# EAGLE design Genesis giraffe1 (EAGLE 9.1.0)
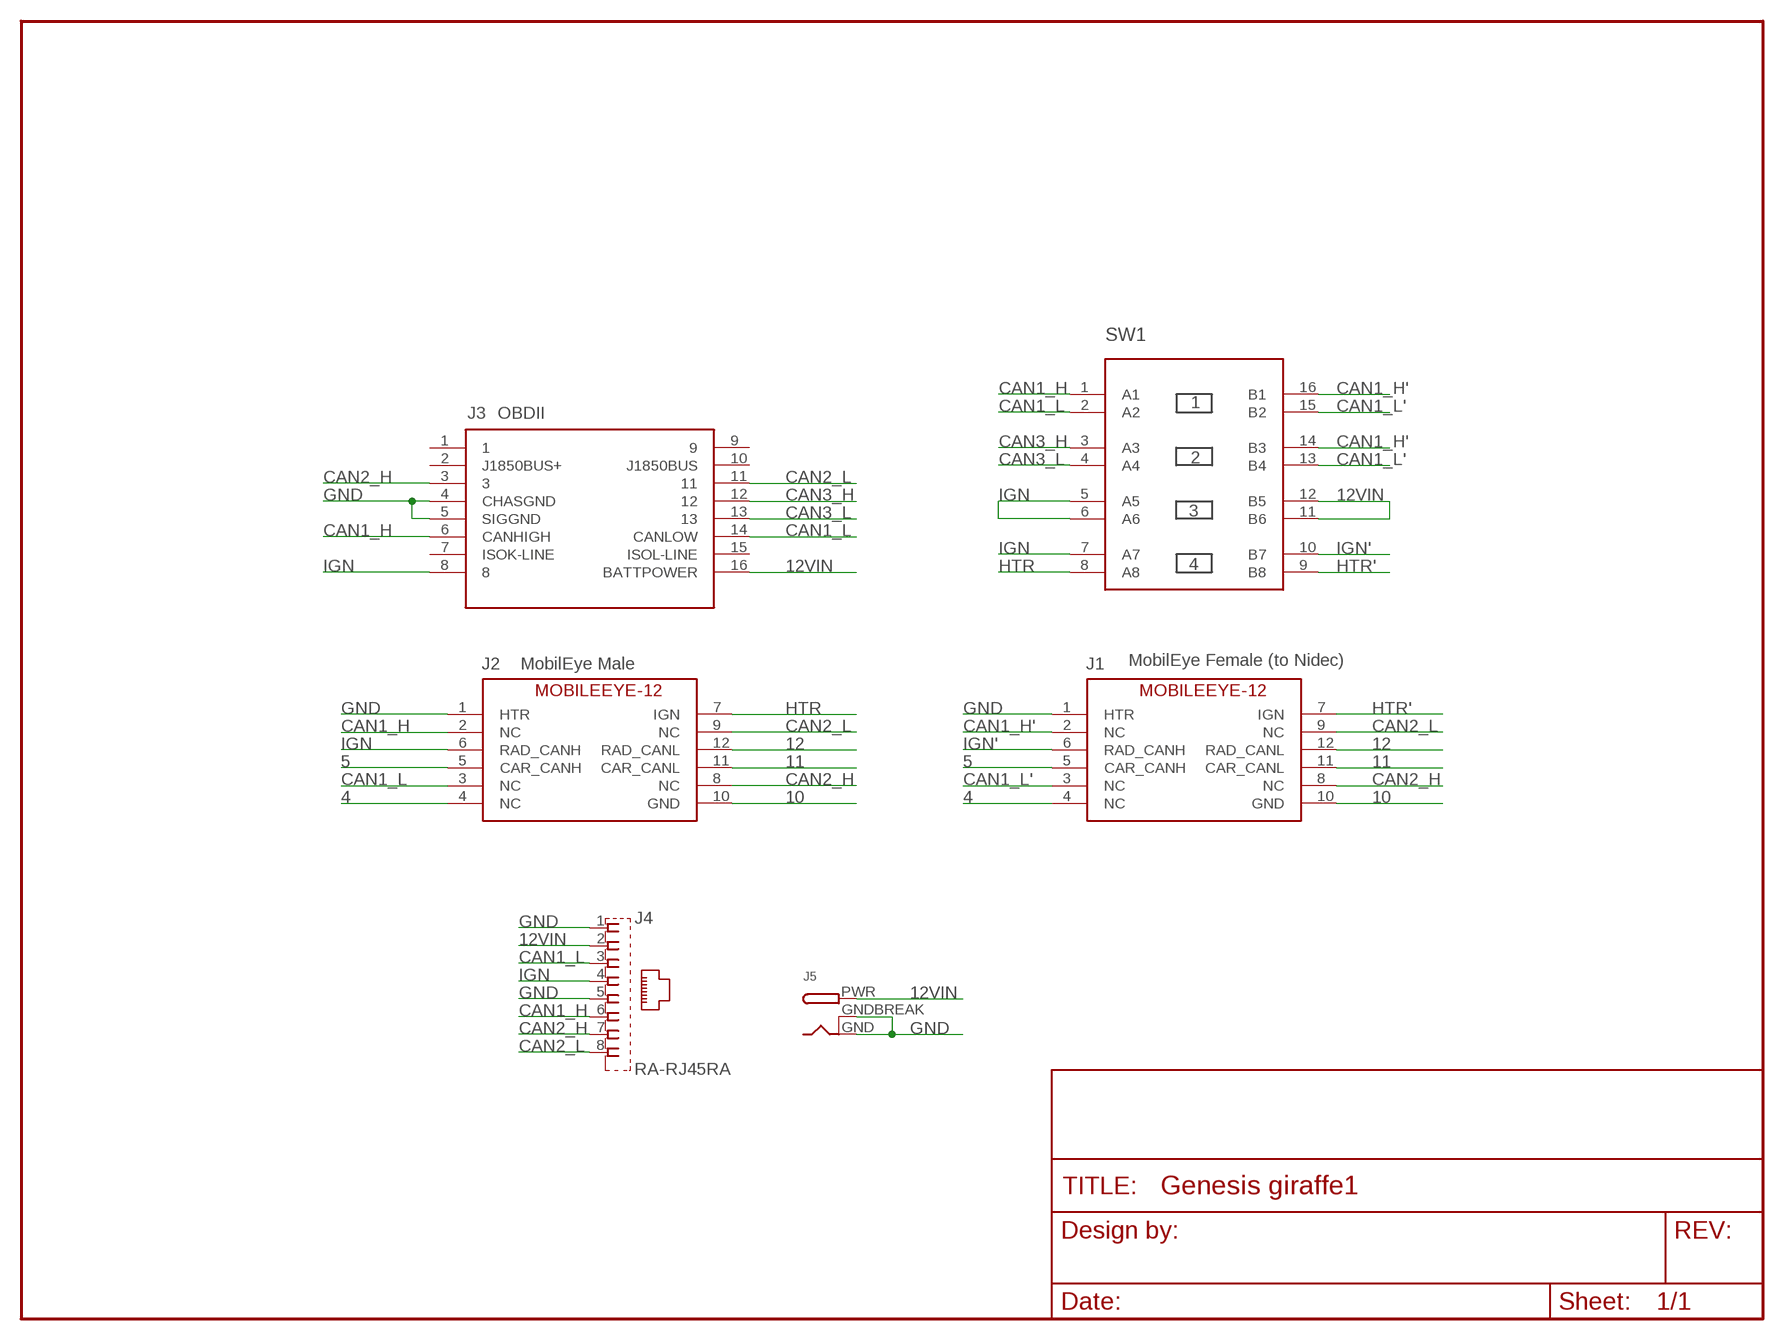
[diagram p0: schematic, sheet 1]

## Parts
FRAME1  FRAME-LETTERNO_PACKAGE  [DUMMY]
J1  MOBILEEYE-12FEMALE  [2X6-TE-FEMALE]
J2  MOBILEEYE-12MALE  [2X6-TE-RA]
J3  OBDII-FEMALE-CUT  [OBDII-FEMALE-MIDCUT]
J4  RA-RJ45RA  [RA-RJ45]
J5  DCBARRELPTH  [DCJACK_2MM_PTH]
SW1  4XDPSTSMT  [4-DPST]

## Nets
4: J1.4(NC) J2.4(NC)
5: J1.5(CAR_CANH) J2.5(CAR_CANH)
10: J1.10(GND) J2.10(GND)
11: J1.11(CAR_CANL) J2.11(CAR_CANL)
12: J1.12(RAD_CANL) J2.12(RAD_CANL)
12VIN: J3.16(BATTPOWER) J4.2 J5.PWR SW1.11(B6) SW1.12(B5)
CAN1_H: J2.2(NC) J3.6(CANHIGH) J4.6 SW1.1(A1)
CAN1_H': J1.2(NC) SW1.14(B3) SW1.16(B1)
CAN1_L: J2.3(NC) J3.14(CANLOW) J4.3 SW1.2(A2)
CAN1_L': J1.3(NC) SW1.13(B4) SW1.15(B2)
CAN2_H: J1.8(NC) J2.8(NC) J3.3 J4.7
CAN2_L: J1.9(NC) J2.9(NC) J3.11 J4.8
CAN3_H: J3.12 SW1.3(A3)
CAN3_L: J3.13 SW1.4(A4)
GND: J1.1(HTR) J2.1(HTR) J3.4(CHASGND) J3.5(SIGGND) J4.1 J4.5 J5.GND J5.GNDBREAK
HTR: J2.7(IGN) SW1.8(A8)
HTR': J1.7(IGN) SW1.9(B8)
IGN: J2.6(RAD_CANH) J3.8 J4.4 SW1.5(A5) SW1.6(A6) SW1.7(A7)
IGN': J1.6(RAD_CANH) SW1.10(B7)
Unconnected: J3.1 J3.2(J1850BUS+) J3.7(ISOK-LINE) J3.9 J3.10(J1850BUS) J3.15(ISOL-LINE)

## Notes on the sheet
- OBDII
- MobilEye Male | MobilEye Female (to Nidec)

## Library data of the parts
FRAME1 = SparkFun-Aesthetics:FRAME-LETTER: Schematic Frame Standard 8.5x11 US Letter frame; DESIGNER: Nobody; VERSION: v01
J1 J2 = comma.ai:MOBILEEYE-12
J3 = comma.ai:OBDII-FEMALE
J4 = comma.ai:RA-RJ45
J5 = adafruit:DCBARREL: 2.0mm DC Barrel Jack DCJACK_2MM_PTH - Through Hole Jack (4UConnector: 05537)
SW1 = comma.ai:4XDPST

## Board
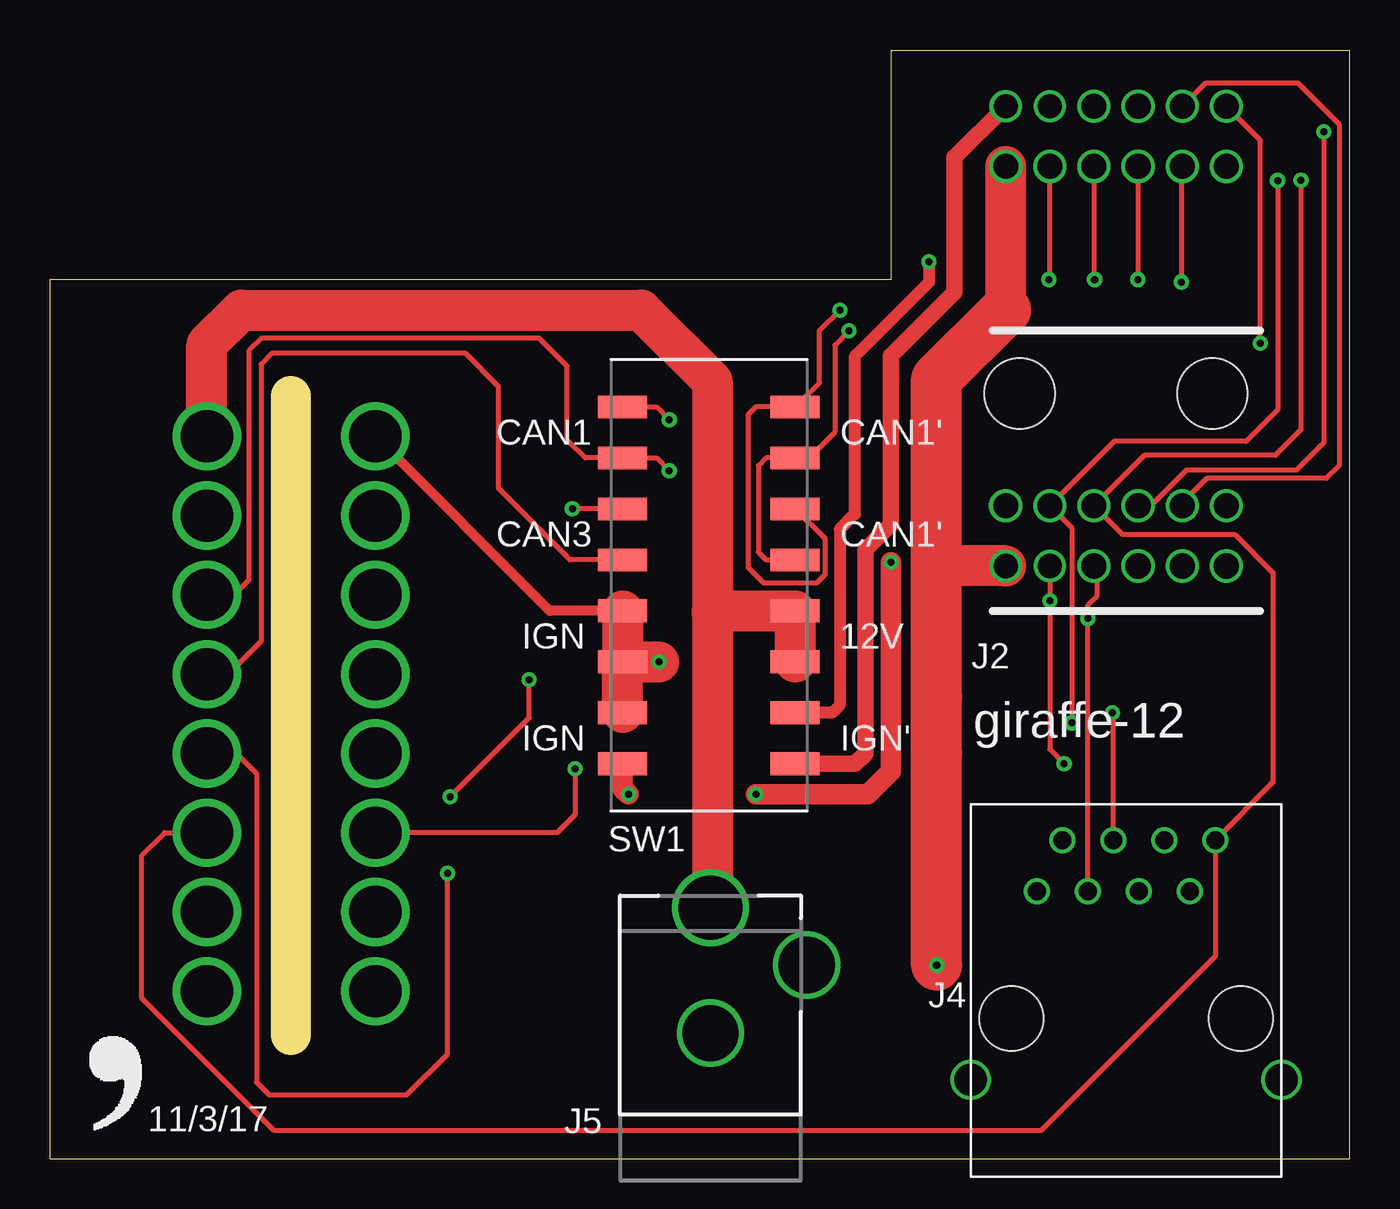
[diagram p1: board, top side]
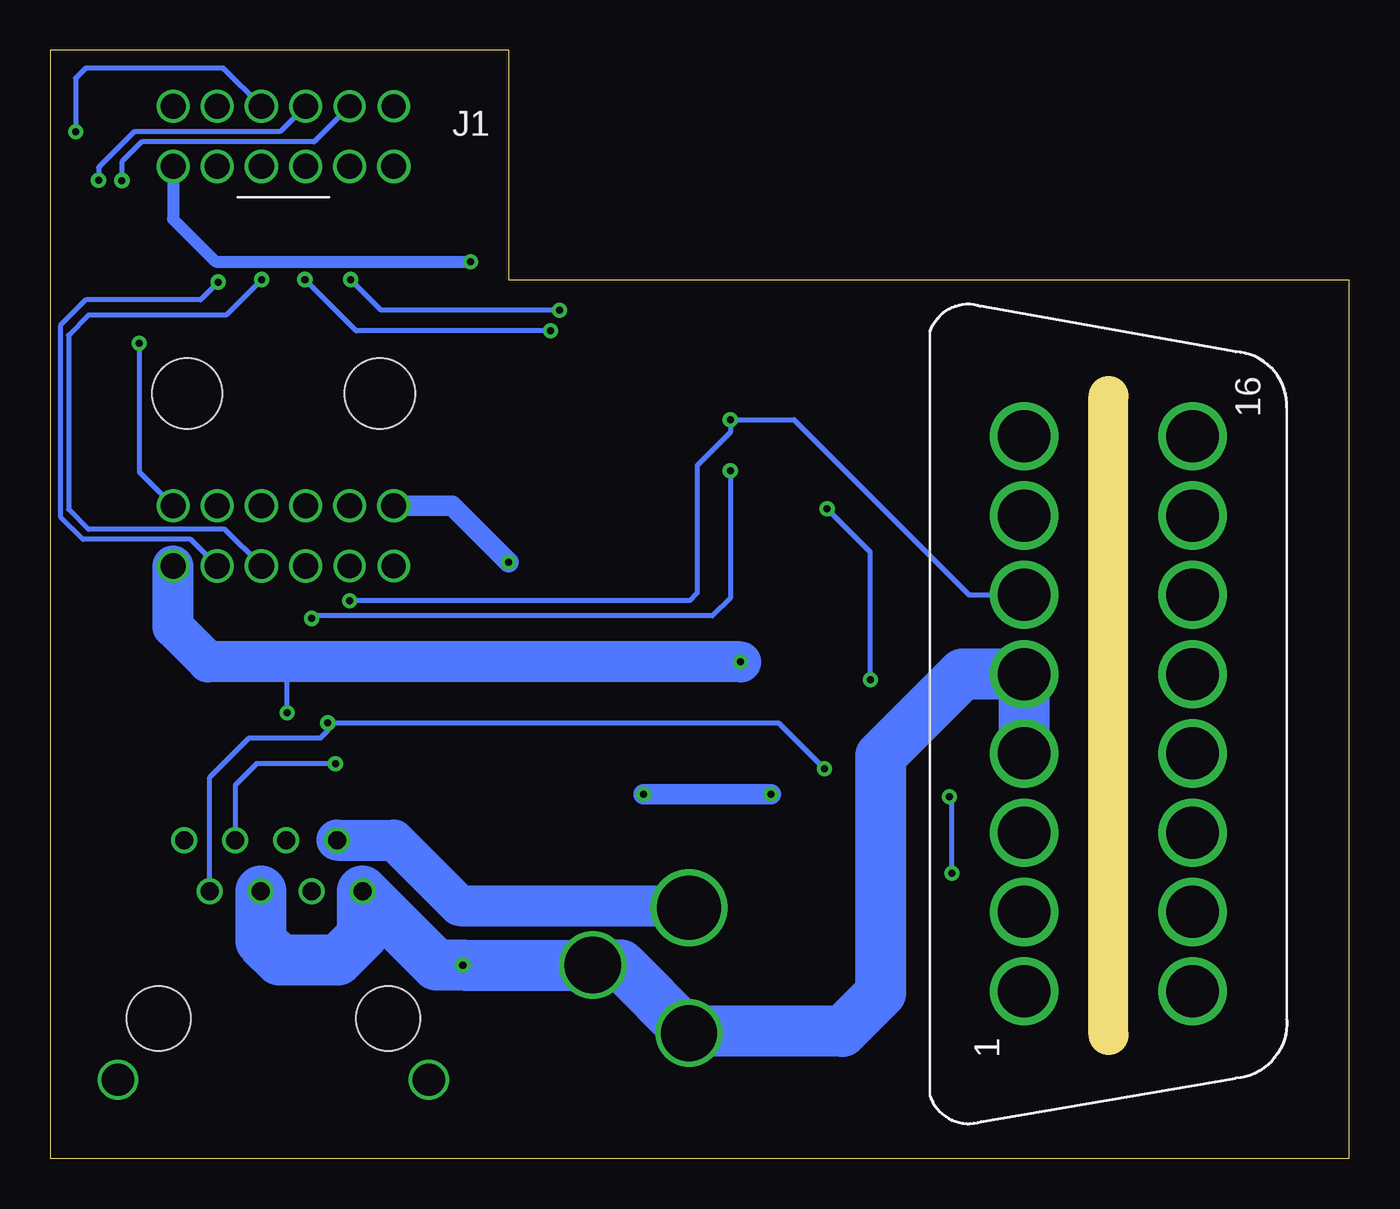
[diagram p2: board, bottom side, seen from below]

Size 64.77 x 55.24 mm. Coordinates in mm from the lower left corner, seen from the top.
Outline: 12.01,6.17 12.01,38
Outline: 41.91,55.24 64.77,55.24 64.77,0 0,0 0,43.81 41.91,43.81 41.91,55.24
Copper layers (1*16): Top 0.035mm / dielectric 1.5mm / Bottom 0.035mm
Design rules "default *": minimum track width 6mil, minimum drill 10mil, track to track 6mil, track to pad 6mil, pad to pad 6mil, via to via 6mil, smd to smd 6mil, copper to edge 15mil, drill to drill 10mil, minimum pad ring 8mil, minimum via ring 8mil, stop-mask expansion 4mil, vias tented up to drill 0mil, thermal gap 10mil

### Footprints (pad centres in the part's own frame; a part is rotated, then mirrored left to right if it is on the bottom)
2X6-TE-FEMALE = drill 1.25: 1 -5.5,1.5; 2 -3.3,1.5; 3 -1.1,1.5; 4 1.1,1.5; 5 3.3,1.5; 6 5.5,1.5; 9 -1.1,-1.5; 10 1.1,-1.5; 11 3.3,-1.5; 12 5.5,-1.5 | drill 1.2: 7 -5.5,-1.5; 8 -3.3,-1.5
2X6-TE-RA = drill 1.2: 1 -5.5,-1.5; 2 -3.3,-1.5 | drill 1.25: 3 -1.1,-1.5; 4 1.1,-1.5; 5 3.3,-1.5; 6 5.5,-1.5; 7 -5.5,1.5; 8 -3.3,1.5; 9 -1.1,1.5; 10 1.1,1.5; 11 3.3,1.5; 12 5.5,1.5 | hole 3.5: -4.8,7.1; 4.8,7.1
OBDII-FEMALE-MIDCUT = drill 2.6 pad 3.4: 1 13.825,-4.2; 2 9.875,-4.2; 3 5.925,-4.2; 4 1.975,-4.2; 5 -1.975,-4.2; 6 -5.925,-4.2; 7 -9.875,-4.2; 8 -13.825,-4.2; 9 13.825,4.2; 10 9.875,4.2; 11 5.925,4.2; 12 1.975,4.2; 13 -1.975,4.2; 14 -5.925,4.2; 15 -9.875,4.2; 16 -13.825,4.2
RA-RJ45 = drill 0.9: 1 -4.445,6.35; 2 -3.175,8.89; 3 -1.905,6.35; 4 -0.635,8.89; 5 0.635,6.35; 6 1.905,8.89; 7 3.175,6.35; 8 4.445,8.89 | drill 1.6: P$1 -7.75,-3.05; P$2 7.75,-3.05 | hole 3.2: -5.715,0; 5.715,0
DCJACK_2MM_PTH = drill 2.8: GND 0,7.35; GNDBREAK 4.8,10.75 | drill 3.2: PWR 0,13.6
4-DPST = smd 1.13 x 2.44: 1 -8.89,-4.3; 2 -6.35,-4.3; 3 -3.81,-4.3; 4 -1.27,-4.3; 5 1.27,-4.3; 6 3.81,-4.3; 7 6.35,-4.3; 8 8.89,-4.3; 9 8.89,4.3; 10 6.35,4.3; 11 3.81,4.3; 12 1.27,4.3; 13 -1.27,4.3; 14 -3.81,4.3; 15 -6.35,4.3; 16 -8.89,4.3

### Placement (x,y rotation side)
FRAME1  -8.89,-10.79 0 top  (outside the outline)
J1  53.14,50.95 180 bottom
J2  53.14,31.04 0 top
J3  12.01,22.17 270 bottom
J4  53.64,6.99 0 top
J5  32.92,-1.09 0 top
SW1  32.84,28.57 270 top
U$1  [LOGO]  1.3,1.12 0 top

### Tracks (layer width: path | path; a pad name or v marks a point on that pad's centre or on a via)
4  (via drill 0.35)
  Top 0.254: J1.4 v54.24,43.81 v54.23,43.81
  Bottom 0.254: J2.4 56.07,31.37 62.87,31.37 63.86,32.36 63.86,41.05 62.87,42.04 56.01,42.04 v54.23,43.81
5  (via drill 0.35)
  Top 0.254: J1.5 56.39,49.45 v56.39,43.69
  Bottom 0.254: J2.5 57.76,30.86 63.12,30.86 64.26,32 64.26,41.53 62.99,42.8 57.28,42.8 v56.39,43.69
10  (via drill 0.35)
  Top 0.254: v63.5,51.18 63.5,35.69 62.13,34.31 56.65,34.31 54.87,32.54 J2.10
  Bottom 0.254: J1.10 56.14,54.36 62.99,54.36 63.5,53.85 v63.5,51.18
11
  Top 0.254: 62.23,53.59 64.26,51.56 64.26,34.54 63.63,33.91 57.66,33.91 56.44,32.69 J2.11 | 62.23,53.59 | 62.23,53.59 57.58,53.59 J1.11
12  (via drill 0.35)
  Top 0.254: v60.33,40.64 60.33,50.76 J1.12
  Bottom 0.254: J2.12 60.33,34.23 60.33,40.51 v60.33,40.64
12VIN
  Top 2.032: J5.PWR 33.02,12.51 33.02,27.18 33.02,27.3 | 33.02,27.3 SW1.12 SW1.11 | J3.16 7.81,40.58 9.53,42.29 29.46,42.29 33.02,38.73 33.02,27.3
  Bottom 2.032: J5.PWR 33.02,12.61 44.36,12.61 47.62,15.88 J4.2
CAN1_H  (via drill 0.35)
  Top 0.254: J2.2 v49.84,27.81 49.84,20.39 v50.55,19.68 | SW1.1 30.23,37.47 v30.86,36.83
  Bottom 0.254: v50.55,19.68 54.48,19.68 55.55,18.62 J4.6 | v49.84,27.81 32.89,27.81 32.51,28.19 32.51,34.54 30.86,36.2 v30.86,36.83 27.69,36.83 18.95,28.1 J3.6
CAN1_H'  (via drill 0.35)
  Top 0.254: v39.37,42.29 38.35,41.27 38.35,38.68 SW1.16 35.18,37.47 34.8,37.08 34.8,29.46 35.56,28.7 38.23,28.7 38.64,29.12 38.64,30.89 SW1.14 | v49.78,43.81 49.84,43.87 J1.2
  Bottom 0.254: v39.37,42.29 48.26,42.29 v49.78,43.81
CAN1_L  (via drill 0.35)
  Top 0.254: J4.3 v51.73,26.92 51.73,27.61 52.2,28.07 52.2,29.38 J2.3 | v30.86,34.29 30.23,34.92 SW1.2 26.67,34.92 25.78,35.81 25.78,39.5 24.38,40.89 | 24.38,40.89 | 24.38,40.89 10.54,40.89 9.91,40.26 9.91,28.83 9.18,28.1 J3.14
  Bottom 0.254: v30.86,34.29 30.86,27.94 31.75,27.05 51.61,27.05 v51.73,26.92
CAN1_L'  (via drill 0.35)
  Top 0.254: v39.82,41.26 39.12,40.55 39.12,36.2 37.85,34.92 SW1.15 35.69,34.92 35.31,34.54 35.31,30.23 35.69,29.84 SW1.13 | v52.07,43.81 52.07,49.42 J1.3
  Bottom 0.254: v39.82,41.26 49.51,41.26 v52.07,43.81
CAN2_H  (via drill 0.35)
  Top 0.254: v50.93,21.72 50.93,31.45 J2.8 53.05,35.75 59.63,35.75 61.19,37.32 v61.19,48.75 | v26.16,19.43 26.16,17.14 25.27,16.26 J3.3
  Bottom 0.254: J4.7 56.81,19 54.86,20.95 51.31,20.95 50.93,21.34 v50.93,21.72 28.45,21.72 v26.16,19.43 | J1.8 51.62,50.67 60.2,50.67 61.19,49.68 v61.19,48.75
CAN2_L  (via drill 0.35)
  Top 0.254: J3.11 5.71,16.25 4.57,15.11 4.57,8 11.18,1.4 49.4,1.4 58.09,10.08 J4.8 60.96,18.75 60.96,29.21 59.05,31.11 53.46,31.11 J2.9 54.55,35.05 61.09,35.05 62.36,36.32 v62.36,48.77
  Bottom 0.254: J1.9 53.31,51.18 60.58,51.18 62.36,49.4 v62.36,48.77
CAN3_H  (via drill 0.35)
  Top 0.254: J3.12 9.27,20.2 10.29,19.18 10.29,3.81 10.92,3.17 17.78,3.17 19.81,5.21 v19.81,14.22 | v19.94,18.03 23.88,21.97 v23.88,23.88 | SW1.3 v26.04,32.38
  Bottom 0.254: v19.81,14.22 19.81,17.91 v19.94,18.03 | v23.88,23.88 23.88,30.23 v26.04,32.38
CAN3_L
  Top 0.254: SW1.4 25.91,29.84 22.35,33.4 22.35,38.48 20.7,40.13 11.05,40.13 10.52,39.6 10.52,25.78 8.88,24.15 J3.13
GND  (via drill 0.35)
  Top 2.032: 47.64,42.3 J1.1 | J2.1 44.25,29.54
  Top 2.54: v44.2,9.65 44.2,20.19 44.2,22.99 44.2,29.59 | 44.2,29.59 44.2,38.86 47.64,42.3 | 44.25,29.54 44.2,29.59
  Bottom 2.54: J4.5 54.27,10.84 53.34,9.91 50.42,9.91 49.2,11.13 J4.1 45.52,9.66 v44.2,9.66 v44.2,9.65 J5.GNDBREAK 36.32,9.66 J5.GND 32.83,6.35 25.27,6.35 23.37,8.26 23.37,20.07 19.29,24.15 J3.5 J3.4
HTR  (via drill 0.35)
  Top 1.016: v28.83,18.16 28.54,18.45 SW1.8 | v35.18,18.16 40.77,18.16 41.91,19.3 v41.91,29.72
  Bottom 1.016: v28.83,18.16 v35.18,18.16 | v41.91,29.72 44.73,32.54 J2.7
HTR'
  Top 0.813: J1.7 45.09,49.9 45.09,43.18 41.91,40.01 41.91,31.62 40.64,30.35 40.64,20.19 40.13,19.68 SW1.9
IGN  (via drill 0.35)
  Top 0.254: J4.4 53.01,22.18 v52.96,22.23
  Top 0.508: SW1.5 24.91,27.3 J3.8
  Top 2.032: SW1.6 v30.35,24.77 | SW1.7 SW1.6 | SW1.5 SW1.6
  Bottom 0.254: v52.96,22.23 52.96,24.77
  Bottom 2.032: v30.35,24.77 52.96,24.77 56.9,24.77 58.64,26.51 J2.6
IGN'  (via drill 0.35)
  Top 0.61: SW1.10 38.99,22.23 39.37,22.61 39.37,31.37 40.13,32.13 40.13,40.01 40.39,40.26 43.81,43.69 v43.81,44.7
  Bottom 0.61: J1.6 58.64,46.83 56.52,44.7 v43.81,44.7

### Text on the board
tPlace: CAN1 | CAN1' | CAN3 | CAN1' | IGN | 12V | giraffe-12 | IGN | IGN' | 11/3/17